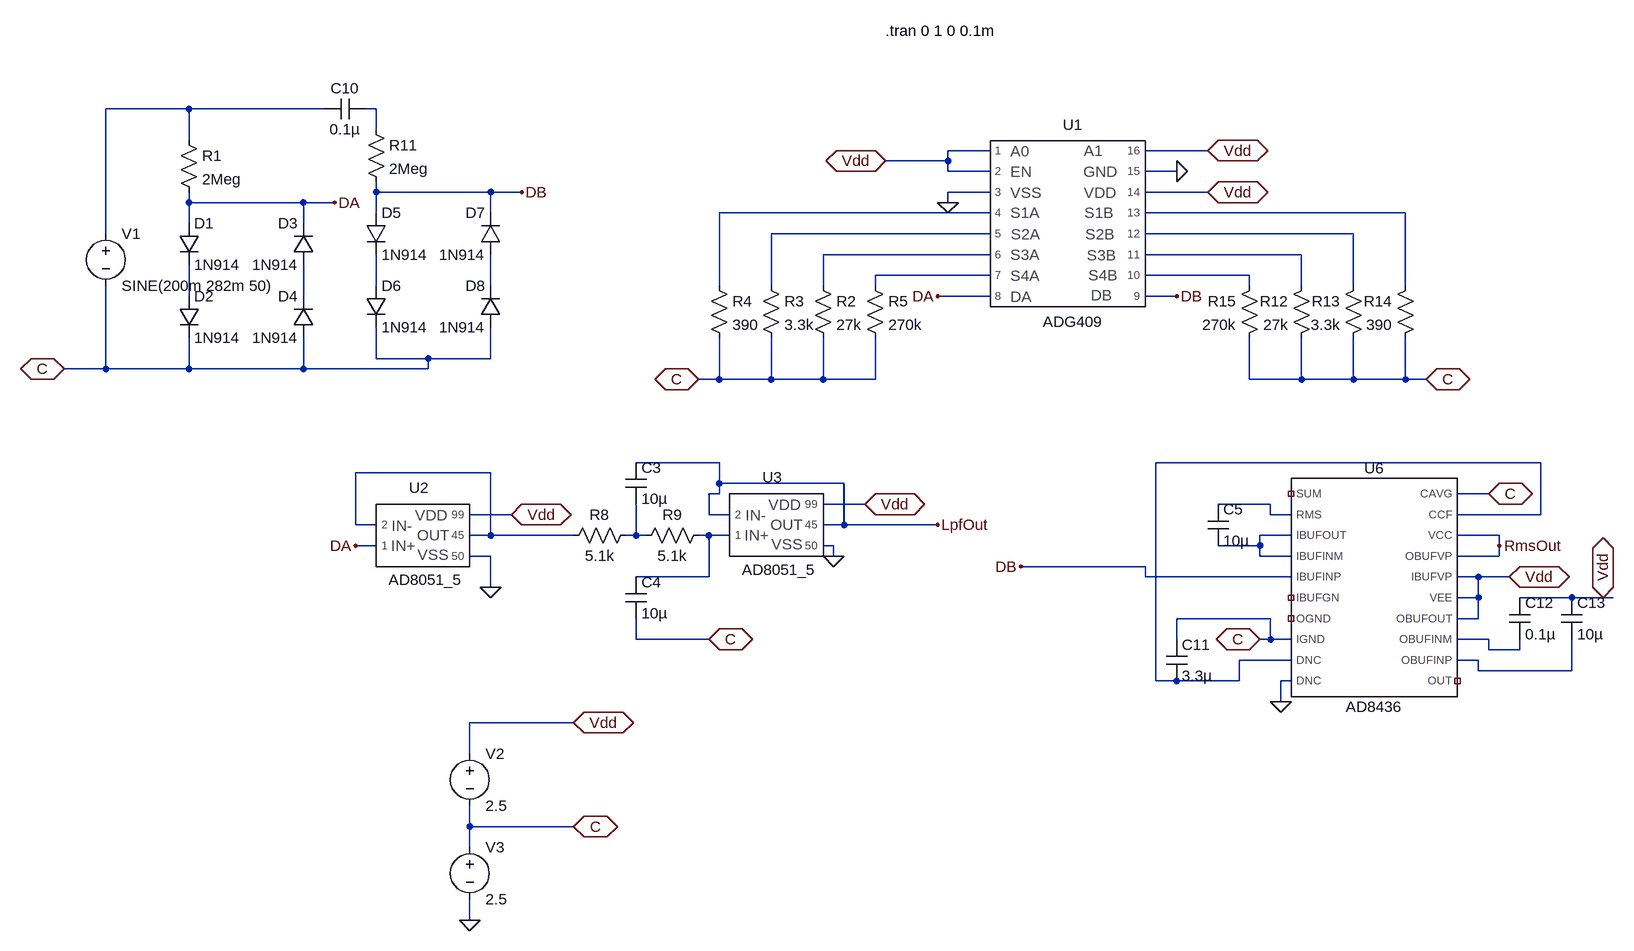
[diagram p0: schematic Circuit.asc]
Circuit.asc, the LTspice schematic file:
Version 4
SHEET 1 2232 1752
WIRE -1072 16 -1200 16
WIRE -864 16 -1072 16
WIRE -784 16 -800 16
WIRE -784 48 -784 16
WIRE -1072 64 -1072 16
WIRE 160 80 96 80
WIRE 496 80 400 80
WIRE 96 96 96 80
WIRE 96 96 0 96
WIRE 96 112 96 96
WIRE 160 112 96 112
WIRE 448 112 400 112
WIRE -784 144 -784 128
WIRE -608 144 -784 144
WIRE -560 144 -608 144
WIRE 160 144 96 144
WIRE 496 144 400 144
WIRE -1072 160 -1072 144
WIRE -896 160 -1072 160
WIRE -848 160 -896 160
WIRE 96 160 96 144
WIRE -784 176 -784 144
WIRE -608 176 -608 144
WIRE 160 176 -256 176
WIRE 800 176 400 176
WIRE -1072 192 -1072 160
WIRE -896 192 -896 160
WIRE -1200 208 -1200 16
WIRE 160 208 -176 208
WIRE 720 208 400 208
WIRE 160 240 -96 240
WIRE 640 240 400 240
WIRE 160 272 -16 272
WIRE 560 272 400 272
WIRE -784 288 -784 240
WIRE -608 288 -608 240
WIRE -256 288 -256 176
WIRE -176 288 -176 208
WIRE -96 288 -96 240
WIRE -16 288 -16 272
WIRE 560 288 560 272
WIRE 640 288 640 240
WIRE 720 288 720 208
WIRE 800 288 800 176
WIRE -1072 304 -1072 256
WIRE -896 304 -896 256
WIRE 160 304 80 304
WIRE 448 304 400 304
WIRE -784 400 -784 352
WIRE -704 400 -784 400
WIRE -608 400 -608 352
WIRE -608 400 -704 400
WIRE -1200 416 -1200 288
WIRE -1200 416 -1264 416
WIRE -1072 416 -1072 368
WIRE -1072 416 -1200 416
WIRE -896 416 -896 368
WIRE -896 416 -1072 416
WIRE -704 416 -704 400
WIRE -704 416 -896 416
WIRE -256 432 -256 368
WIRE -256 432 -288 432
WIRE -176 432 -176 368
WIRE -176 432 -256 432
WIRE -96 432 -96 368
WIRE -96 432 -176 432
WIRE -16 432 -16 368
WIRE -16 432 -96 432
WIRE 560 432 560 368
WIRE 640 432 640 368
WIRE 640 432 560 432
WIRE 720 432 720 368
WIRE 720 432 640 432
WIRE 800 432 800 368
WIRE 800 432 720 432
WIRE 832 432 800 432
WIRE -256 560 -384 560
WIRE 1008 560 416 560
WIRE -608 576 -816 576
WIRE -256 592 -256 560
WIRE -64 592 -256 592
WIRE -256 608 -256 592
WIRE -256 608 -272 608
WIRE 928 608 880 608
WIRE -32 624 -96 624
WIRE 592 624 512 624
WIRE -576 640 -640 640
WIRE -272 640 -272 608
WIRE -240 640 -272 640
WIRE 592 640 592 624
WIRE 624 640 592 640
WIRE 1008 640 1008 560
WIRE 1008 640 880 640
WIRE -816 656 -816 576
WIRE -784 656 -816 656
WIRE -64 656 -64 592
WIRE -64 656 -96 656
WIRE 80 656 -64 656
WIRE -608 672 -608 576
WIRE -608 672 -640 672
WIRE -480 672 -608 672
WIRE -384 672 -384 624
WIRE -384 672 -400 672
WIRE -368 672 -384 672
WIRE -272 672 -288 672
WIRE -240 672 -272 672
WIRE 624 672 576 672
WIRE 944 672 880 672
WIRE -784 688 -816 688
WIRE -80 688 -96 688
WIRE 576 688 576 672
WIRE 576 688 512 688
WIRE 944 688 944 672
WIRE -608 704 -640 704
WIRE -80 704 -80 688
WIRE 576 704 576 688
WIRE 624 704 576 704
WIRE 944 704 944 688
WIRE 944 704 880 704
WIRE 400 720 208 720
WIRE -272 736 -272 672
WIRE -272 736 -384 736
WIRE 400 736 400 720
WIRE 624 736 400 736
WIRE 912 736 880 736
WIRE 960 736 912 736
WIRE -608 752 -608 704
WIRE 912 768 912 736
WIRE 912 768 880 768
WIRE 1056 768 976 768
WIRE 1104 768 1056 768
WIRE 1120 768 1104 768
WIRE 592 800 448 800
WIRE 912 800 912 768
WIRE 912 800 880 800
WIRE -384 832 -384 800
WIRE -272 832 -384 832
WIRE 448 832 448 800
WIRE 592 832 592 800
WIRE 592 832 576 832
WIRE 624 832 592 832
WIRE 928 832 880 832
WIRE 928 848 928 832
WIRE 976 848 976 832
WIRE 976 848 928 848
WIRE 624 864 544 864
WIRE 912 864 880 864
WIRE 912 880 912 864
WIRE 1056 880 1056 832
WIRE 1056 880 912 880
WIRE 416 896 416 560
WIRE 448 896 416 896
WIRE 544 896 544 864
WIRE 544 896 448 896
WIRE 624 896 608 896
WIRE 608 928 608 896
WIRE -480 960 -640 960
WIRE -640 1008 -640 960
WIRE -640 1120 -640 1088
WIRE -480 1120 -640 1120
WIRE -640 1152 -640 1120
WIRE -640 1264 -640 1232
FLAG -1264 416 C
IOPIN -1264 416 BiDir
FLAG -848 160 DA
FLAG -480 960 Vdd
IOPIN -480 960 BiDir
FLAG -640 1264 0
FLAG -480 1120 C
IOPIN -480 1120 BiDir
FLAG 0 96 Vdd
IOPIN 0 96 BiDir
FLAG 96 160 0
FLAG 80 304 DA
FLAG -816 688 DA
FLAG -288 432 C
IOPIN -288 432 BiDir
FLAG -272 832 C
IOPIN -272 832 BiDir
FLAG 80 656 LpfOut
FLAG -560 144 DB
FLAG 496 80 Vdd
IOPIN 496 80 BiDir
FLAG 448 112 0
FLAG 496 144 Vdd
IOPIN 496 144 BiDir
FLAG 448 304 DB
FLAG 832 432 C
IOPIN 832 432 BiDir
FLAG 608 928 0
FLAG 928 608 C
IOPIN 928 608 BiDir
FLAG 576 832 C
IOPIN 576 832 BiDir
FLAG 944 688 RmsOut
FLAG 960 736 Vdd
IOPIN 960 736 BiDir
FLAG 1104 768 Vdd
IOPIN 1104 768 BiDir
FLAG 208 720 DB
FLAG -608 752 0
FLAG -576 640 Vdd
IOPIN -576 640 BiDir
FLAG -80 704 0
FLAG -32 624 Vdd
IOPIN -32 624 BiDir
SYMBOL res -1088 48 R0
SYMATTR InstName R1
SYMATTR Value 2Meg
SYMBOL diode -1088 192 R0
SYMATTR InstName D1
SYMATTR Value 1N914
SYMBOL diode -1088 304 R0
SYMATTR InstName D2
SYMATTR Value 1N914
SYMBOL diode -880 256 R180
WINDOW 0 24 64 Left 2
WINDOW 3 24 0 Left 2
SYMATTR InstName D3
SYMATTR Value 1N914
SYMBOL diode -880 368 R180
WINDOW 0 24 64 Left 2
WINDOW 3 24 0 Left 2
SYMATTR InstName D4
SYMATTR Value 1N914
SYMBOL voltage -1200 192 R0
WINDOW 123 0 0 Left 2
WINDOW 39 0 0 Left 2
SYMATTR InstName V1
SYMATTR Value SINE(200m 282m 50)
SYMBOL voltage -640 992 R0
SYMATTR InstName V2
SYMATTR Value 2.5
SYMBOL voltage -640 1136 R0
SYMATTR InstName V3
SYMATTR Value 2.5
SYMBOL res -112 272 R0
SYMATTR InstName R2
SYMATTR Value 27k
SYMBOL res -192 272 R0
SYMATTR InstName R3
SYMATTR Value 3.3k
SYMBOL res -272 272 R0
SYMATTR InstName R4
SYMATTR Value 390
SYMBOL res -32 272 R0
SYMATTR InstName R5
SYMATTR Value 270k
SYMBOL res -384 656 R90
WINDOW 0 0 56 VBottom 2
WINDOW 3 32 56 VTop 2
SYMATTR InstName R8
SYMATTR Value 5.1k
SYMBOL res -272 656 R90
WINDOW 0 0 56 VBottom 2
WINDOW 3 32 56 VTop 2
SYMATTR InstName R9
SYMATTR Value 5.1k
SYMBOL cap -400 560 R0
SYMATTR InstName C3
SYMATTR Value 10µ
SYMBOL cap -400 736 R0
SYMATTR InstName C4
SYMATTR Value 10µ
SYMBOL cap 496 624 R0
SYMATTR InstName C5
SYMATTR Value 10µ
SYMBOL res -800 32 R0
SYMATTR InstName R11
SYMATTR Value 2Meg
SYMBOL diode -800 176 R0
SYMATTR InstName D5
SYMATTR Value 1N914
SYMBOL diode -800 288 R0
SYMATTR InstName D6
SYMATTR Value 1N914
SYMBOL diode -592 240 R180
WINDOW 0 24 64 Left 2
WINDOW 3 24 0 Left 2
SYMATTR InstName D7
SYMATTR Value 1N914
SYMBOL diode -592 352 R180
WINDOW 0 24 64 Left 2
WINDOW 3 24 0 Left 2
SYMATTR InstName D8
SYMATTR Value 1N914
SYMBOL cap -800 0 R90
WINDOW 0 0 32 VBottom 2
WINDOW 3 32 32 VTop 2
SYMATTR InstName C10
SYMATTR Value 0.1µ
SYMBOL ADG409 288 192 R0
SYMATTR InstName U1
SYMBOL res 656 272 M0
SYMATTR InstName R12
SYMATTR Value 27k
SYMBOL res 736 272 M0
SYMATTR InstName R13
SYMATTR Value 3.3k
SYMBOL res 816 272 M0
SYMATTR InstName R14
SYMATTR Value 390
SYMBOL res 576 272 M0
SYMATTR InstName R15
SYMATTR Value 270k
SYMBOL AutoGenerated\\AD8436 752 752 R0
SYMATTR InstName U6
SYMBOL cap 432 832 R0
SYMATTR InstName C11
SYMATTR Value 3.3µ
SYMBOL cap 960 768 R0
SYMATTR InstName C12
SYMATTR Value 0.1µ
SYMBOL cap 1040 768 R0
SYMATTR InstName C13
SYMATTR Value 10µ
SYMBOL AD8051_5 -720 672 R0
SYMATTR InstName U2
SYMBOL AD8051_5 -176 656 R0
SYMATTR InstName U3
TEXT 0 -104 Left 2 !.tran 0 1 0 0.1m

The netlist it stands for:
* Circuit.asc
R1 N001 DA 2Meg
D1 DA N013 1N914
D2 N013 C 1N914
D3 N014 DA 1N914
D4 C N014 1N914
V1 N001 C SINE(200m 282m 50)
V2 Vdd C 2.5
V3 C 0 2.5
R2 N007 C 27k
R3 N005 C 3.3k
R4 N003 C 390
R5 N009 C 270k
R8 N018 N016 5.1k
R9 N019 N018 5.1k
C3 LpfOut N018 10µ
C4 N019 C 10µ
C5 N017 N020 10µ
R11 N002 DB 2Meg
D5 DB N011 1N914
D6 N011 C 1N914
D7 N012 DB 1N914
D8 C N012 1N914
C10 N002 N001 0.1µ
XU1 N003 N005 N007 N009 N004 N006 N008 N010 Vdd Vdd Vdd DA DB Vdd 0 0 ADG409  ; pins 4 5 6 7 13 12 11 10 16 1 2 8 9 14 15 3
R12 N008 C 27k
R13 N006 C 3.3k
R14 N004 C 390
R15 N010 C 270k
XU6 N015 N017 N020 N020 DB NC_01 0 NC_02 NC_03 Vdd C N022 N021 Vdd RmsOut Vdd RmsOut N015 C NC_04 AD8436  ; pins DNC RMS IBUFOUT IBUFINM IBUFINP IBUFGN DNC OGND OUT VEE IGND OBUFINP OBUFINM OBUFOUT OBUFVP IBUFVP VCC CCF CAVG SUM
C11 C N015 3.3µ
C12 Vdd N021 0.1µ
C13 Vdd N022 10µ
XU2 DA N016 Vdd 0 N016 AD8051_5  ; pins 1 2 99 50 45
XU3 N019 LpfOut Vdd 0 LpfOut AD8051_5  ; pins 1 2 99 50 45
.model D D
.lib standard.dio
.tran 0 1 0 0.1m
.lib C:\Users\Semenov_DM\Desktop\All\Library\adg409.cir
.lib C:\Users\Artemka\Downloads\ad8436.cir
.lib C:\Users\Semenov_DM\Desktop\All\Library\ad8051_5.cir
.backanno
.end